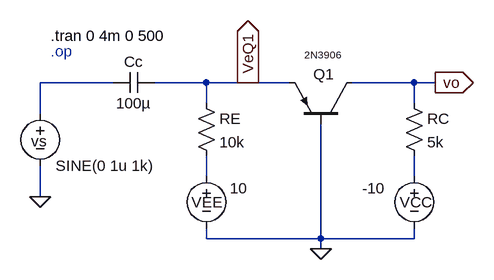
[diagram p0: schematic chap6_test6_13.asc]
chap6_test6_13.asc, the LTspice schematic file:
Version 4
SHEET 1 880 680
WIRE -96 128 -208 128
WIRE 48 128 -32 128
WIRE 112 128 48 128
WIRE 176 128 112 128
WIRE 368 128 272 128
WIRE 400 128 368 128
WIRE 48 160 48 128
WIRE 368 160 368 128
WIRE -208 176 -208 128
WIRE 48 272 48 240
WIRE 368 272 368 240
WIRE -208 304 -208 256
WIRE 48 368 48 352
WIRE 224 368 224 192
WIRE 224 368 48 368
WIRE 368 368 368 352
WIRE 368 368 224 368
WIRE 224 384 224 368
FLAG -208 304 0
FLAG 224 384 0
FLAG 400 128 vo
IOPIN 400 128 Out
FLAG 112 128 VeQ1
IOPIN 112 128 Out
SYMBOL pnp 272 192 M270
WINDOW 0 77 59 VLeft 2
WINDOW 3 107 73 VLeft 1
SYMATTR InstName Q1
SYMATTR Value 2N3906
SYMBOL voltage -208 160 R0
WINDOW 0 -14 58 Left 2
WINDOW 123 0 0 Left 0
WINDOW 39 0 0 Left 0
SYMATTR InstName vs
SYMATTR Value SINE(0 1u 1k)
SYMBOL voltage 48 256 R0
WINDOW 0 -23 56 Left 2
WINDOW 3 36 35 Left 2
SYMATTR InstName VEE
SYMATTR Value 10
SYMBOL voltage 368 256 R0
WINDOW 0 -22 56 Left 2
WINDOW 3 -80 35 Left 2
SYMATTR InstName VCC
SYMATTR Value -10
SYMBOL res 32 144 R0
SYMATTR InstName RE
SYMATTR Value 10k
SYMBOL res 352 144 R0
SYMATTR InstName RC
SYMATTR Value 5k
SYMBOL cap -32 112 R90
WINDOW 0 0 32 VBottom 2
WINDOW 3 32 32 VTop 2
SYMATTR InstName Cc
SYMATTR Value 100µ
TEXT -192 80 Left 2 ;.op
TEXT -192 56 Left 2 !.tran 0 4m 0 500

The netlist it stands for:
* chap6_test6_13.asc
Q1 vo 0 VeQ1 0 2N3906
vs N001 0 SINE(0 1u 1k)
VEE N002 0 10
VCC N003 0 -10
RE VeQ1 N002 10k
RC vo N003 5k
Cc VeQ1 N001 100µ
.model NPN NPN
.model PNP PNP
.lib standard.bjt
* .op
.tran 0 4m 0 500
.backanno
.end